# Altium schematic sheet LTC2335-16_1.SchDoc
size A; SheetNumber: 11; SheetTotal: 24
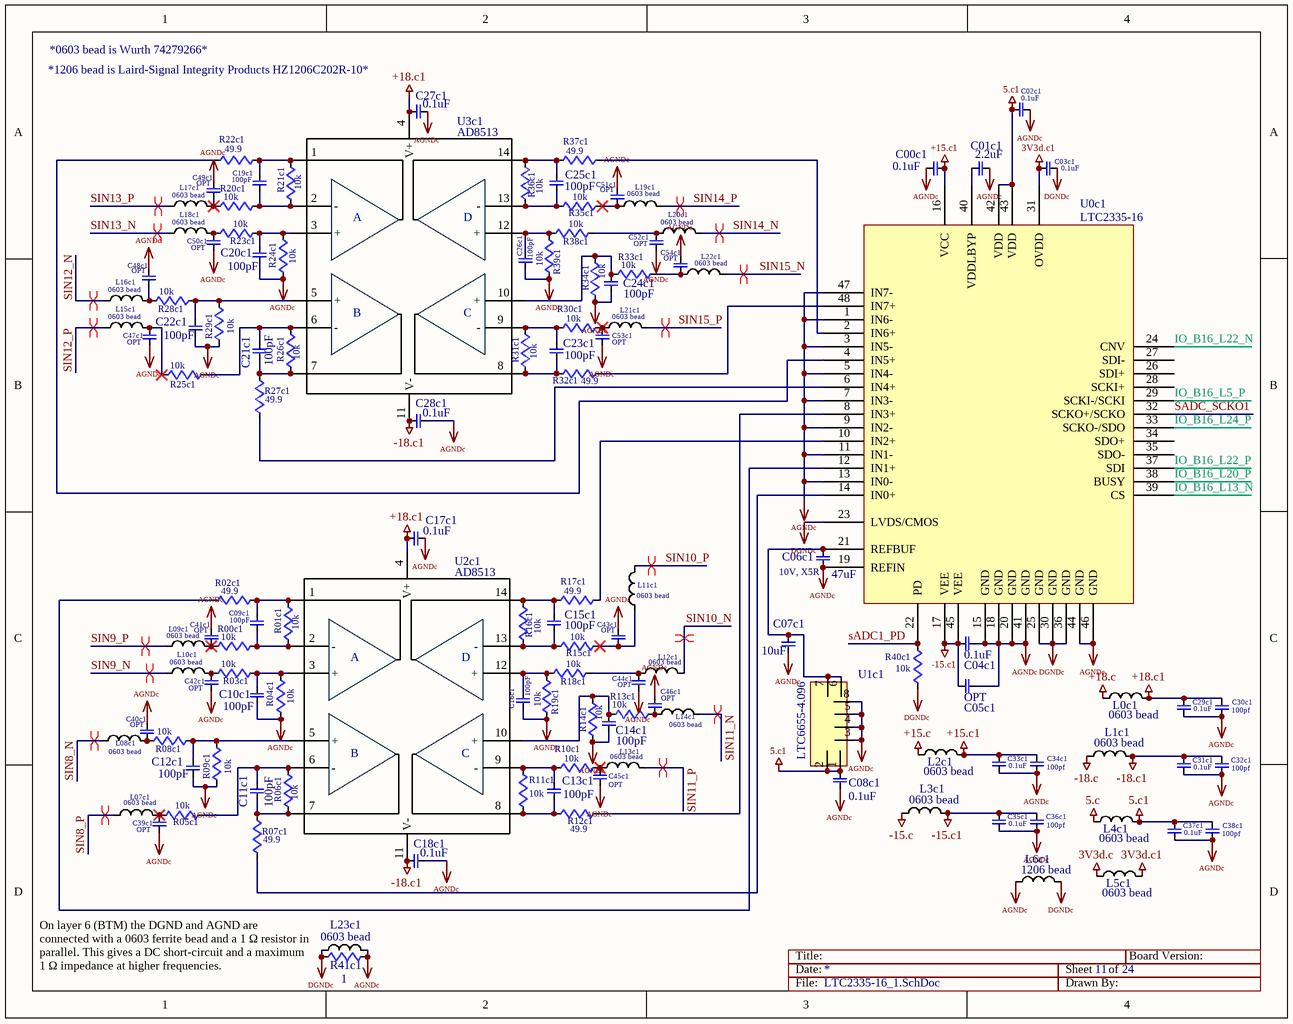
[diagram p0: LTC2335-16_1.SchDoc]

## Parts
C00c1  0.1uF  [0603]
C01c1  2.2uF  [0603]
C02c1  0.1uF  [0603]
C03c1  0.1uF  [0603]
C04c1  0.1uF  [0603]
C05c1  OPT  [0603]
C06c1  47uF  [1210]
C07c1  10uF  [0805]
C08c1  0.1uF  [0603]
C09c1  100pF  [0603]
C10c1  100pF  [0603]
C11c1  100pF  [0603]
C12c1  100pF  [0603]
C13c1  100pF  [0603]
C14c1  100pF  [0603]
C15c1  100pF  [0603]
C16c1  100pF  [0603]
C17c1  0.1uF  [0603]
C18c1  0.1uF  [0603]
C19c1  100pF  [0603]
C20c1  100pF  [0603]
C21c1  100pF  [0603]
C22c1  100pF  [0603]
C23c1  100pF  [0603]
C24c1  100pF  [0603]
C25c1  100pF  [0603]
C26c1  100pF  [0603]
C27c1  0.1uF  [0603]
C28c1  0.1uF  [0603]
C29c1  0.1uF  [0603]
C30c1  100pf  [0603]
C31c1  0.1uF  [0603]
C32c1  100pf  [0603]
C33c1  0.1uF  [0603]
C34c1  100pf  [0603]
C35c1  0.1uF  [0603]
C36c1  100pf  [0603]
C37c1  0.1uF  [0603]
C38c1  100pf  [0603]
C39c1  OPT  [0603]
C40c1  OPT  [0603]
C41c1  OPT  [0603]
C42c1  OPT  [0603]
C43c1  OPT  [0603]
C44c1  OPT  [0603]
C45c1  OPT  [0603]
C46c1  OPT  [0603]
C47c1  OPT  [0603]
C48c1  OPT  [0603]
C49c1  OPT  [0603]
C50c1  OPT  [0603]
C51c1  OPT  [0603]
C52c1  OPT  [0603]
C53c1  OPT  [0603]
C54c1  OPT  [0603]
L0c1  0603 bead  [0603]
L1c1  0603 bead  [0603]
L2c1  0603 bead  [0603]
L3c1  0603 bead  [0603]
L4c1  0603 bead  [0603]
L5c1  0603 bead  [0603]
L6c1  1206 bead  [1206]
L07c1  0603 bead  [0603]
L08c1  0603 bead  [0603]
L09c1  0603 bead  [0603]
L10c1  0603 bead  [0603]
L11c1  0603 bead  [0603]
L12c1  0603 bead  [0603]
L13c1  0603 bead  [0603]
L14c1  0603 bead  [0603]
L15c1  0603 bead  [0603]
L16c1  0603 bead  [0603]
L17c1  0603 bead  [0603]
L18c1  0603 bead  [0603]
L19c1  0603 bead  [0603]
L20c1  0603 bead  [0603]
L21c1  0603 bead  [0603]
L22c1  0603 bead  [0603]
L23c1  0603 bead  [0603]
R00c1  10k  [0603]
R01c1  10k  [0603]
R02c1  49.9  [0603]
R03c1  10k  [0603]
R04c1  10k  [0603]
R05c1  10k  [0603]
R06c1  10k  [0603]
R07c1  49.9  [0603]
R08c1  10k  [0603]
R09c1  10k  [0603]
R10c1  10k  [0603]
R11c1  10k  [0603]
R12c1  49.9  [0603]
R13c1  10k  [0603]
R14c1  10k  [0603]
R15c1  10k  [0603]
R16c1  10k  [0603]
R17c1  49.9  [0603]
R18c1  10k  [0603]
R19c1  10k  [0603]
R20c1  10k  [0603]
R21c1  10k  [0603]
R22c1  49.9  [0603]
R23c1  10k  [0603]
R24c1  10k  [0603]
R25c1  10k  [0603]
R26c1  10k  [0603]
R27c1  49.9  [0603]
R28c1  10k  [0603]
R29c1  10k  [0603]
R30c1  10k  [0603]
R31c1  10k  [0603]
R32c1  49.9  [0603]
R33c1  10k  [0603]
R34c1  10k  [0603]
R35c1  10k  [0603]
R36c1  10k  [0603]
R37c1  49.9  [0603]
R38c1  10k  [0603]
R39c1  10k  [0603]
R40c1  10k  [0603]
R41c1  1  [0603]
U0c1  LTC2335-16  [48LQFP]
U1c1  LTC6655-4.096  [8MSOP_1]
U2c1  AD8513  [14TSSOP]
U3c1  AD8513  [14TSSOP]

## Nets
3V3d.c: L5c1.1
3V3d.c1: C03c1.2 L5c1.2 U0c1.31(OVDD)
5.c: L4c1.1
5.c1: C02c1.2 C08c1.2 C37c1.1 C38c1.1 L4c1.2 U0c1.42(VDD) U0c1.43(VDD) U1c1.1(SHDN) U1c1.2(VIN)
+15.c: L2c1.1
+15.c1: C00c1.1 C33c1.1 C34c1.1 L2c1.2 U0c1.16(VCC)
+18.c: L0c1.1
+18.c1: C17c1.2 C27c1.2 C29c1.1 C30c1.1 L0c1.2 U2c1.4(V+) U3c1.4(V+)
-15.c: L3c1.1
-15.c1: C04c1.2 C05c1.2 C35c1.1 C36c1.1 L3c1.2 U0c1.17(VEE) U0c1.45(VEE)
-18.c: L1c1.1
-18.c1: C18c1.2 C28c1.2 C31c1.1 C32c1.1 L1c1.2 U2c1.11(V-) U3c1.11(V-)
AGNDc: C00c1.2 C01c1.1 C02c1.1 C04c1.1 C05c1.1 C06c1.1 C07c1.1 C08c1.1 C10c1.2 C12c1.2 C14c1.2 C16c1.2 C17c1.1 C18c1.1 C20c1.2 C22c1.2 C24c1.1 C26c1.2 C27c1.1 C28c1.1 C29c1.2 C30c1.2 C31c1.2 C32c1.2 C33c1.2 C34c1.2 C35c1.2 C36c1.2 C37c1.2 C38c1.2 C39c1.2 C40c1.1 C41c1.1 C42c1.2 C43c1.1 C44c1.1 C45c1.1 C46c1.1 C47c1.2 C48c1.1 C49c1.1 C50c1.2 C51c1.1 C52c1.2 C53c1.2 C54c1.1 L6c1.1 L23c1.2 R04c1.1 R09c1.1 R14c1.1 R19c1.1 R24c1.1 R29c1.1 R34c1.1 R39c1.1 R41c1.1 U0c1.1(IN6-) U0c1.3(IN5-) U0c1.5(IN4-) U0c1.7(IN3-) U0c1.9(IN2-) U0c1.11(IN1-) U0c1.13(IN0-) U0c1.15(GND) U0c1.18(GND) U0c1.19(REFIN) U0c1.20(GND) U0c1.41(GND) U0c1.44(GND) U0c1.46(GND) U0c1.47(IN7-) U1c1.3(GND) U1c1.4(GND) U1c1.5(GND) U1c1.8(GND)
DGNDc: C03c1.1 L6c1.2 L23c1.1 R40c1.1 R41c1.2 U0c1.23(LVDS/CMOS) U0c1.25(GND) U0c1.30(GND) U0c1.36(GND)
IO_B16_L5_P: U0c1.29(SCKI-/SCKI)
IO_B16_L13_N: U0c1.39(CS)
IO_B16_L20_P: U0c1.38(BUSY)
IO_B16_L22_N: U0c1.24(CNV)
IO_B16_L22_P: U0c1.37(SDI)
IO_B16_L24_P: U0c1.33(SCKO-/SDO)
sADC1_PD: R40c1.2 U0c1.22(PD)
SADC_SCKO1: U0c1.32(SCKO+/SCKO)
SIN8_N: L08c1.1
SIN8_P: L07c1.1
SIN9_N: L10c1.1
SIN9_P: L09c1.1
SIN10_N: L12c1.2
SIN10_P: L11c1.2
SIN11_N: L14c1.2
SIN11_P: L13c1.2
SIN12_N: L16c1.1
SIN12_P: L15c1.1
SIN13_N: L18c1.1
SIN13_P: L17c1.1
SIN14_N: L20c1.2
SIN14_P: L19c1.2
SIN15_N: L22c1.2
SIN15_P: L21c1.2
NetC01c1_2: C01c1.2 U0c1.40(VDDLBYP)
NetC06c1_2: C06c1.2 C07c1.2 U0c1.21(REFBUF) U1c1.6(VOUT_S) U1c1.7(VOUT_F)
NetC09c1_1: C09c1.1 R01c1.2 R02c1.2 U2c1.1(OUTA)
NetC09c1_2: C09c1.2 R00c1.2 R01c1.1 U2c1.2(-)
NetC10c1_1: C10c1.1 R03c1.2 R04c1.2 U2c1.3(+)
NetC11c1_1: C11c1.1 R06c1.1 R07c1.2 U2c1.7(OUTB)
NetC11c1_2: C11c1.2 R05c1.1 R06c1.2 U2c1.6(-)
NetC12c1_1: C12c1.1 R08c1.2 R09c1.2 U2c1.5(+)
NetC13c1_1: C13c1.1 R11c1.1 R12c1.1 U2c1.8(OUTB)
NetC13c1_2: C13c1.2 R10c1.1 R11c1.2 U2c1.9(-)
NetC14c1_1: C14c1.1 R13c1.1 R14c1.2 U2c1.10(+)
NetC15c1_1: C15c1.1 R16c1.2 R17c1.1 U2c1.14(OUTA)
NetC15c1_2: C15c1.2 R15c1.1 R16c1.1 U2c1.13(-)
NetC16c1_1: C16c1.1 R18c1.1 R19c1.2 U2c1.12(+)
NetC19c1_1: C19c1.1 R21c1.2 R22c1.2 U3c1.1(OUTA)
NetC19c1_2: C19c1.2 R20c1.2 R21c1.1 U3c1.2(-)
NetC20c1_1: C20c1.1 R23c1.2 R24c1.2 U3c1.3(+)
NetC21c1_1: C21c1.1 R26c1.1 R27c1.2 U3c1.7(OUTB)
NetC21c1_2: C21c1.2 R25c1.1 R26c1.2 U3c1.6(-)
NetC22c1_1: C22c1.1 R28c1.2 R29c1.2 U3c1.5(+)
NetC23c1_1: C23c1.1 R31c1.1 R32c1.1 U3c1.8(OUTB)
NetC23c1_2: C23c1.2 R30c1.1 R31c1.2 U3c1.9(-)
NetC24c1_2: C24c1.2 R33c1.1 R34c1.2 U3c1.10(+)
NetC25c1_1: C25c1.1 R36c1.2 R37c1.1 U3c1.14(OUTA)
NetC25c1_2: C25c1.2 R35c1.1 R36c1.1 U3c1.13(-)
NetC26c1_1: C26c1.1 R38c1.1 R39c1.2 U3c1.12(+)
NetC39c1_1: C39c1.1 L07c1.2 R05c1.2
NetC40c1_2: C40c1.2 L08c1.2 R08c1.1
NetC41c1_2: C41c1.2 L09c1.2 R00c1.1
NetC42c1_1: C42c1.1 L10c1.2 R03c1.1
NetC43c1_2: C43c1.2 L11c1.1 R15c1.2
NetC44c1_2: C44c1.2 L12c1.1 R18c1.2
NetC45c1_2: C45c1.2 L13c1.1 R10c1.2
NetC46c1_2: C46c1.2 L14c1.1 R13c1.2
NetC47c1_1: C47c1.1 L15c1.2 R25c1.2
NetC48c1_2: C48c1.2 L16c1.2 R28c1.1
NetC49c1_2: C49c1.2 L17c1.2 R20c1.1
NetC50c1_1: C50c1.1 L18c1.2 R23c1.1
NetC51c1_2: C51c1.2 L19c1.1 R35c1.2
NetC52c1_1: C52c1.1 L20c1.1 R38c1.2
NetC53c1_1: C53c1.1 L21c1.1 R30c1.2
NetC54c1_2: C54c1.2 L22c1.1 R33c1.2
NetR02c1_1: R02c1.1 U0c1.12(IN1+)
NetR07c1_1: R07c1.1 U0c1.14(IN0+)
NetR12c1_2: R12c1.2 U0c1.8(IN3+)
NetR17c1_2: R17c1.2 U0c1.10(IN2+)
NetR22c1_1: R22c1.1 U0c1.4(IN5+)
NetR27c1_1: R27c1.1 U0c1.6(IN4+)
NetR32c1_2: R32c1.2 U0c1.48(IN7+)
NetR37c1_2: R37c1.2 U0c1.2(IN6+)

Not connected (* = marked no-connect by the designer): U0c1 26(SDI+) 27(SDI-) 28(SCKI+) 34(SDO+) 35(SDO-)

## Layout directives
differential pair: SIN8_N, SIN8_P, SIN9_N, SIN9_P, SIN10_N, SIN10_P, SIN11_N, SIN11_P, SIN12_N, SIN12_P, SIN13_N, SIN13_P, SIN14_N, SIN14_P, SIN15_N, SIN15_P

## Notes on the sheet
- (near C27c1) *1206 bead is Laird-Signal Integrity Products HZ1206C202R-10*
- *0603 bead is Wurth 74279266*
- (near C06c1) 10V, X5R
- Title:
- Date:
- Sheet
- of
- Board Version:
- On layer 6 (BTM) the DGND and AGND are connected with a 0603 ferrite bead and a 1 Ω resistor in parallel. This gives a DC short-circuit and a maximum 1 Ω impedance at higher frequencies.
- File:
- Drawn By:
- (in symbol OPAMPx4) A; D; B; C

## Library data of the parts
C00c1 C01c1 C02c1 C03c1 C04c1 C05c1 C06c1 C07c1 C08c1 C09c1 C10c1 C11c1 C12c1 C13c1 C14c1 C15c1 C16c1 C17c1 C18c1 C19c1 C20c1 C21c1 C22c1 C23c1 C24c1 C25c1 C26c1 C27c1 C28c1 C29c1 C30c1 C31c1 C32c1 C33c1 C34c1 C35c1 C36c1 C37c1 C38c1 C39c1 C40c1 C41c1 C42c1 C43c1 C44c1 C45c1 C46c1 C47c1 C48c1 C49c1 C50c1 C51c1 C52c1 C53c1 C54c1 = CAP
L0c1 L1c1 L2c1 L3c1 L4c1 L5c1 L6c1 L07c1 L08c1 L09c1 L10c1 L11c1 L12c1 L13c1 L14c1 L15c1 L16c1 L17c1 L18c1 L19c1 L20c1 L21c1 L22c1 L23c1 = INDUCTOR
R00c1 R01c1 R02c1 R03c1 R04c1 R05c1 R06c1 R07c1 R08c1 R09c1 R10c1 R11c1 R12c1 R13c1 R14c1 R15c1 R16c1 R17c1 R18c1 R19c1 R20c1 R21c1 R22c1 R23c1 R24c1 R25c1 R26c1 R27c1 R28c1 R29c1 R30c1 R31c1 R32c1 R33c1 R34c1 R35c1 R36c1 R37c1 R38c1 R39c1 R40c1 R41c1 = RES
U1c1 = LTC6655
U2c1 U3c1 = OPAMPx4